# Altium schematic sheet Central_Unit.SchDoc
size A3; Organization: ETML-ES; Address1: Avenue Recordon 1; Address2: 1004 Lausanne; Address3: Switzerland; SheetNumber: 6; SheetTotal: 6
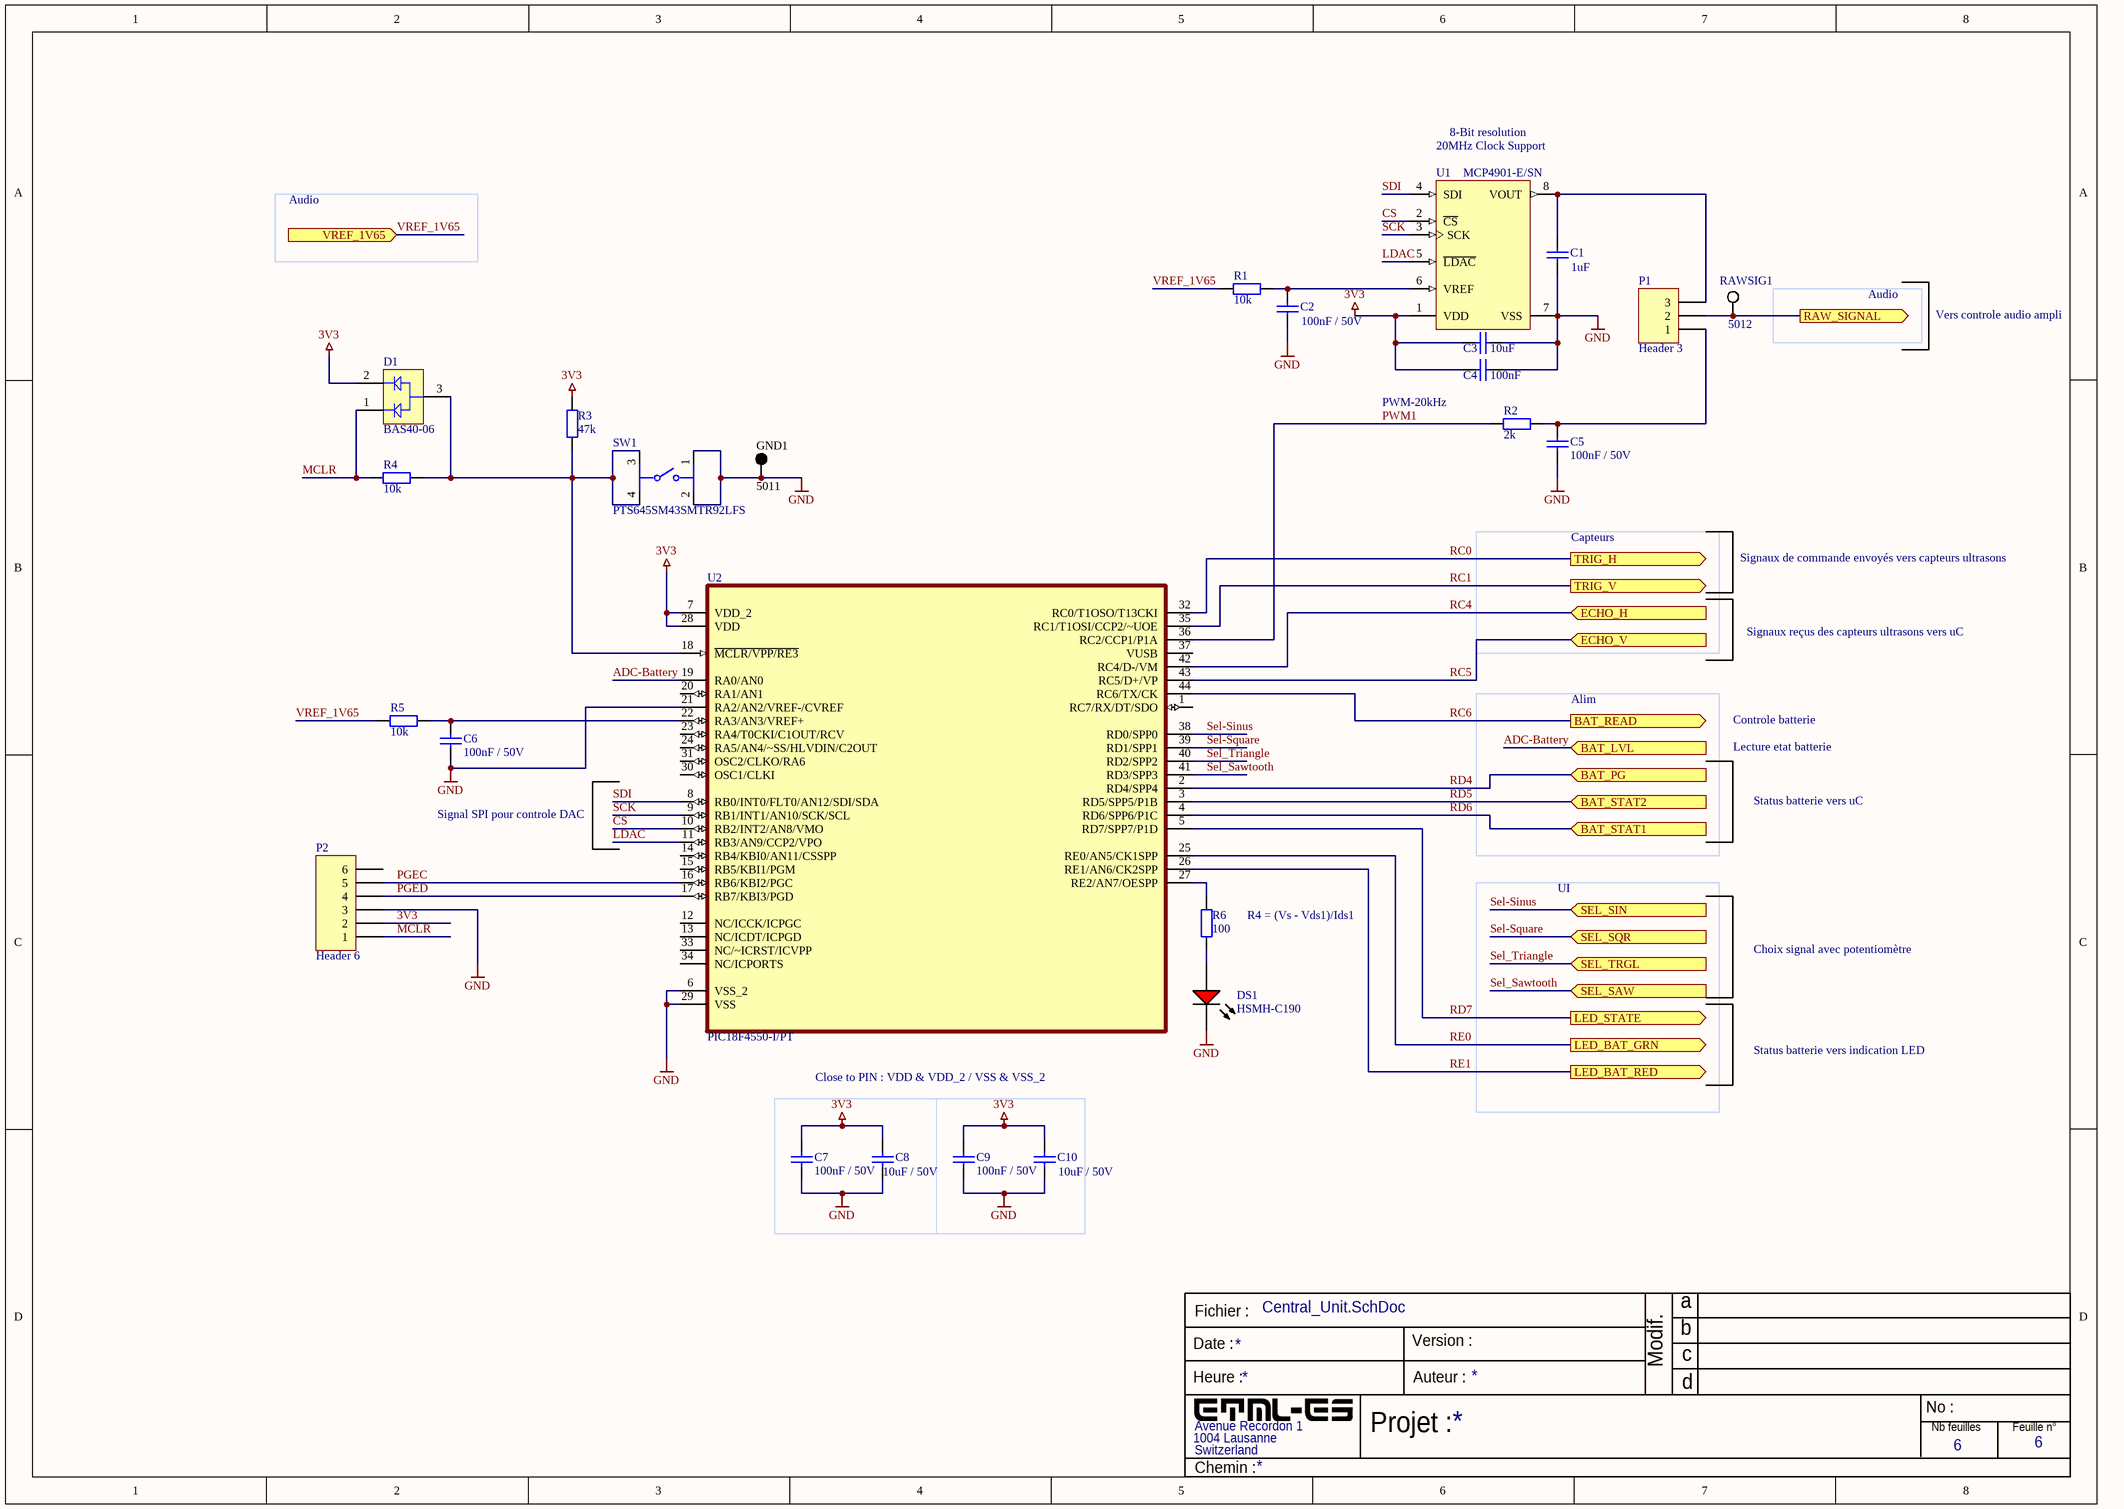
[diagram p0: Central_Unit.SchDoc]

## Parts
C1  1uF  [CAPC0805]
C2  100nF / 50V  [CAPC0805]
C3  10uF  [CAPC0805]
C4  100nF  [CAPC0805]
C5  100nF / 50V  [CAPC0805]
C6  100nF / 50V  [CAPC0805]
C7  100nF / 50V  [CAPC0805]
C8  10uF / 50V  [CAPC0805]
C9  100nF / 50V  [CAPC0805]
C10  10uF / 50V  [CAPC0805]
D1  BAS40-06  [INF-SOT23_M]
DS1  HSMH-C190  [AVAG-HSMX-C190_V]
GND1  5011  [KSTN-5011_V]
P1  Header 3  [PIN-1x03_2.54]
P2  Header 6  [PIN-1x06_2.54]
R1  10k  [RESC0805]
R2  2k  [RESC0805]
R3  47k  [RESC0805]
R4  10k  [RESC0805]
R5  10k  [RESC0805]
R6  100  [RESC0805]
RAWSIG1  5012  [KSTN-5012_V]
SW1  PTS645SM43SMTR92LFS  [FP-PTS645SM43SMTR92LFS-MFG]
U1  MCP4901-E/SN  [SOIC-SN8_N]
U2  PIC18F4550-I/PT  [TQFP80P1200X1200X120-44M]

## Blocks framed on the sheet
Close to PIN : VDD & VDD_2 / VSS & VSS_2: C7 C8

## Ports
BAT_LVL (in), BAT_PG (in), BAT_READ (out), BAT_STAT1 (in), BAT_STAT2 (in), ECHO_H (in), ECHO_V (in), LED_BAT_GRN (out), LED_BAT_RED (out), LED_STATE (out), RAW_SIGNAL (out), SEL_SAW (in), SEL_SIN (in), SEL_SQR (in), SEL_TRGL (in), TRIG_H (out), TRIG_V (out), VREF_1V65 (in)

## Nets
3V3: C3.1 C4.1 C7.1 C8.1 C9.1 C10.1 D1.2(K2) P2.2 R3.1 U1.1(VDD) U2.7(VDD_2) U2.28(VDD)
GND: C1.2 C2.2 C3.2 C4.2 C5.2 C6.2 C7.2 C8.2 C9.2 C10.2 DS1.2(K) GND1.1 P2.3 SW1.1 SW1.2 U1.7(VSS) U2.6(VSS_2) U2.21(RA2/AN2/VREF-/CVREF) U2.29(VSS)
ADC-Battery: U2.19(RA0/AN0) ; port BAT_LVL
CS: U1.2(~{CS}) U2.10(RB2/INT2/AN8/VMO)
LDAC: U1.5(~{LDAC}) U2.11(RB3/AN9/CCP2/VPO)
MCLR: D1.1(K1) P2.1 R4.2
PGEC: P2.5 U2.16(RB6/KBI2/PGC)
PGED: P2.4 U2.17(RB7/KBI3/PGD)
PWM1: R2.2 U2.36(RC2/CCP1/P1A)
RAW_SIGNAL: P1.2 RAWSIG1.1 ; port RAW_SIGNAL
RC0: U2.32(RC0/T1OSO/T13CKI) ; port TRIG_H
RC1: U2.35(RC1/T1OSI/CCP2/~UOE) ; port TRIG_V
RC4: U2.42(RC4/D-/VM) ; port ECHO_H
RC5: U2.43(RC5/D+/VP) ; port ECHO_V
RC6: U2.44(RC6/TX/CK) ; port BAT_READ
RD4: U2.2(RD4/SPP4) ; port BAT_PG
RD5: U2.3(RD5/SPP5/P1B) ; port BAT_STAT2
RD6: U2.4(RD6/SPP6/P1C) ; port BAT_STAT1
RD7: U2.5(RD7/SPP7/P1D) ; port LED_STATE
RE0: U2.25(RE0/AN5/CK1SPP) ; port LED_BAT_GRN
RE1: U2.26(RE1/AN6/CK2SPP) ; port LED_BAT_RED
SCK: U1.3(SCK) U2.9(RB1/INT1/AN10/SCK/SCL)
SDI: U1.4(SDI) U2.8(RB0/INT0/FLT0/AN12/SDI/SDA)
Sel-Sinus: U2.38(RD0/SPP0) ; port SEL_SIN
Sel-Square: U2.39(RD1/SPP1) ; port SEL_SQR
Sel_Sawtooth: U2.41(RD3/SPP3) ; port SEL_SAW
Sel_Triangle: U2.40(RD2/SPP2) ; port SEL_TRGL
VREF_1V65: R1.2 R5.2 ; port VREF_1V65
NetC1_1: C1.1 P1.3 U1.8(VOUT)
NetC2_1: C2.1 R1.1 U1.6(VREF)
NetC5_1: C5.1 P1.1 R2.1
NetC6_1: C6.1 R5.1 U2.22(RA3/AN3/VREF+)
NetD1_3: D1.3(A) R3.2 R4.1 SW1.3 SW1.4 U2.18(~{MCLR/VPP/RE3})
NetDS1_1: DS1.1(A) R6.2
NetR6_1: R6.1 U2.27(RE2/AN7/OESPP)

Not connected (* = marked no-connect by the designer): P2 6; U2 1(RC7/RX/DT/SDO) 12(NC/ICCK/ICPGC) 13(NC/ICDT/ICPGD) 14(RB4/KBI0/AN11/CSSPP) 15(RB5/KBI1/PGM) 20(RA1/AN1) 23(RA4/T0CKI/C1OUT/RCV) 24(RA5/AN4/~SS/HLVDIN/C2OUT) 30(OSC1/CLKI) 31(OSC2/CLKO/RA6) 33(NC/~ICRST/ICVPP) 34(NC/ICPORTS) 37(VUSB)

## Notes on the sheet
- (near U1) 20MHz Clock Support
- 8-Bit resolution
- Audio
- Vers controle audio ampli
- PWM-20kHz
- Capteurs
- Signaux de commande envoyés vers capteurs ultrasons
- Signaux reçus des capteurs ultrasons vers uC
- Alim
- Controle batterie
- Lecture etat batterie
- Signal SPI pour controle DAC
- Status batterie vers uC
- (near R6) R4 = (Vs - Vds1)/Ids1
- UI
- Choix signal avec potentiomètre
- Status batterie vers indication LED
- Fichier :
- a
- Date :
- Heure :
- Version :
- Auteur :
- Modif.
- b
- c
- d
- Projet :
- No :
- Nb feuilles
- Feuille n°
- Chemin :

## Library data of the parts
C1-C10 = Cap: Capacitor; Published: 8-Jun-2000; LatestRevisionDate: 17-Jul-2002; LatestRevisionNote: Re-released for DXP Platform.; PackageReference: RAD-0.3; Publisher: Altium Limited; PackageDescription: Radial Cap, Thru-Hole; 2 Leads; 0.3 in Pin Spacing
D1 = CMP-1182-00022-1: Silicon Schottky Diode, -55 to 150 degC, SOT23, Reel, Green; Manufacturer: Infineon; Configuration: Dual; VR (max): 40Â V; IF (max): 120Â mA; Green: TRUE; VF (max): 1,000Â mV; CT (max): 5Â pF; ComponentLink2Description: Datasheet; Packing: Reel; PackageVersion: Apr-08; PartNumber: BAS40-06; ComponentLink2URL: http://www.infineon.com/dgdl/bas40_bas140series.pdf?folderId=db3a30431400ef68011425f1ca2505e3&fileId=db3a304314dca389011518a57ed20e11; PackageReference: SOT23; Mounting Technology: Surface Mount; ComponentLink3Description: Package Specification; PackageDescription: 3-Pin Small Outline Transistor Package, 1.3 x 2.9 mm Body, 0.95 mm Pitch; ComponentLink1URL: http://www.infineon.com/; ComponentLink3URL: http://www.infineon.com/dgdl/SOT23-Package_Overview.pdf?folderId=db3a30431936bc4b0119532290053c66&fileId=db3a30431936bc4b0119533468123c85; ComponentLink1Description: Manufacturer URL
DS1 = CMP-1744-00004-1: LED Uni-Color Red, 65 mW, 20 mA, -40 to 85 degC, 2-Pin SMD, RoHS, Tape and Reel; Connector Type: USB; Gender: Male; Current Rating: 1 A; Length: 7.5 mm; Lead Pitch: 0.65 mm; PackageReference: HSMX-C190; Package Quantity: 2000; Max Operating Temperature: 85 degC; PackageDescription: 2-Pin Surface Mount Device, Body 1.6 x 0.8 mm, Height 0.9 mm; ComponentLink3Description: Package Specification; Mount: Surface Mount; Min Operating Temperature: -30 degC; ComponentLink3URL: http://www.fairchildsemi.com/dwg/MA/MA03D.pdf; ComponentLink1Description: Manufacturer URL; Contact Material: Copper; Pins: 5; Width: 5.6 mm; ComponentLink2Description: Datasheet; RoHSCompliant: true; DatasheetVersion: Mar-12; Height: 2.8 mm; Packaging: Tape and Reel; Contact Plating: Gold; ComponentLink1URL: http://www.avagotech.com/; REACH SVHC: No SVHC; ComponentLink2URL: http://docs.avagotech.com/docs/AV02-0551EN
GND1 = CMP-1672-00003-4: Test Point, Black, Through Hole, RoHS, Bulk; Manufacturer: Keystone; ComponentLink2URL: http://www.keyelco.com/product-pdf.cfm?p=1320; Colour: Black; Pins: 1; REACH SVHC: No SVHC; ComponentLink1URL: http://www.keyelco.com/; PackageReference: 5011; Contact Plating: Silver; Package Quantity: 100; Packaging: Bulk; RoHSCompliant: true; Height: 8.12 mm; PackageDescription: 1-Pin Through Hole Device, Dia 3.17 mm; Mount: Through Hole; Mounting Technology: Through Hole; DatasheetVersion: Rev. F, 12/2013; ComponentLink1Description: Manufacturer URL; Contact Material: Bronze; ComponentLink2Description: Datasheet
P1 = Header 3: Header, 3-Pin; LatestRevisionDate: 17-Jul-2002; LatestRevisionNote: Re-released for DXP Platform.; Publisher: Altium Limited
P2 = Header 6: Header, 6-Pin; LatestRevisionDate: 17-Jul-2002; LatestRevisionNote: Re-released for DXP Platform.; Publisher: Altium Limited
R1-R6 = RES: Resistor
RAWSIG1 = CMP-1672-00004-4: Test Point, White, Through Hole, RoHS, Bulk; Manufacturer: Keystone; DatasheetVersion: Rev. F, 12/2013; ComponentLink1URL: http://www.keyelco.com/; PackageReference: 5012; RoHSCompliant: true; ComponentLink2Description: Datasheet; Colour: White; Contact Material: Bronze; PackageDescription: 1-Pin Through Hole Device, Dia 3.17 mm; Mounting Technology: Through Hole; Mount: Through Hole; Package Quantity: 100; ComponentLink1Description: Manufacturer URL; Pins: 1; Height: 8.12 mm; Packaging: Bulk; REACH SVHC: No SVHC; Contact Plating: Silver; Length: 11.3 mm; ComponentLink2URL: http://www.keyelco.com/product-pdf.cfm?p=1321
SW1 = CMP-2000-05160-2: SWITCH TACTILE SPST-NO 0.05A 12V; Contact Resistance: 100mR; Throw Configuration: SPST; Illumination Type: Non-Illuminated; Mechanical Life: 100000Cycles; Current Rating: 50mA; Switch Function: Off-Mom; Actuator Length: 0.85mm; Actuator Material: Nylon; Actuator Type: Standard; Operating Force: 160gf; Min Operating Temperature: -20°C; REACH SVHC: No SVHC; Termination: Gull Wing; Case/Package: SMD/SMT; Packaging: Tape and Reel; Mount: Surface Mount; Voltage Rating (DC): 12V; Orientation: Straight; Lead Free: Lead Free; Contact Material: Silver; Color: Black; Max Current Rating: 50mA; Contact Plating: Silver; Depth: 9mm; Package Quantity: 1; Max Voltage Rating (DC): 12V; Length: 6mm; Max Operating Temperature: 60°C
U1 = CMP-0188-01155-1: 8-Bit DAC with SPI Interface, 8-Pin SOIC 150mil, Extended Temperature; ComponentLink1URL: http://www.microchip.com/; Code_JEDEC: MS-012; ComponentLink2Description: Datasheet; PackageDescription: 8-Lead Plastic Small Outline (SN) - Narrow, 3.90mm Body [SOIC]; ComponentLink3URL: http://www.microchip.com/stellent/groups/techpub_sg/documents/packagingspec/en012702.pdf; ComponentLink3Description: Package Specification; PackageVersion: revBB, Aug-2009; ComponentLink1Description: Manufacturer URL; Code_IPC: SOIC127P600-8; PackageReference: SOIC-SN8; ComponentLink2URL: http://ww1.microchip.com/downloads/en/DeviceDoc/22248a.pdf; DatasheetVersion: revA, Apr-2010
U2 = PIC18F4550-I/PT: PIC PICÂ® 18F Microcontroller IC 8-Bit 48MHz 32KB _16K x 16_ FLASH 44-TQFP _10x10_; MF: Microchip; MP: PIC18F4550-I/PT; Package: TQFP-44 Microchip; Price: None; Value: *; SnapEDA_Link: https://www.snapeda.com/parts/PIC18F4550-I/PT/Microchip/view-part/4713/?ref=snap; Availability: Unavailable